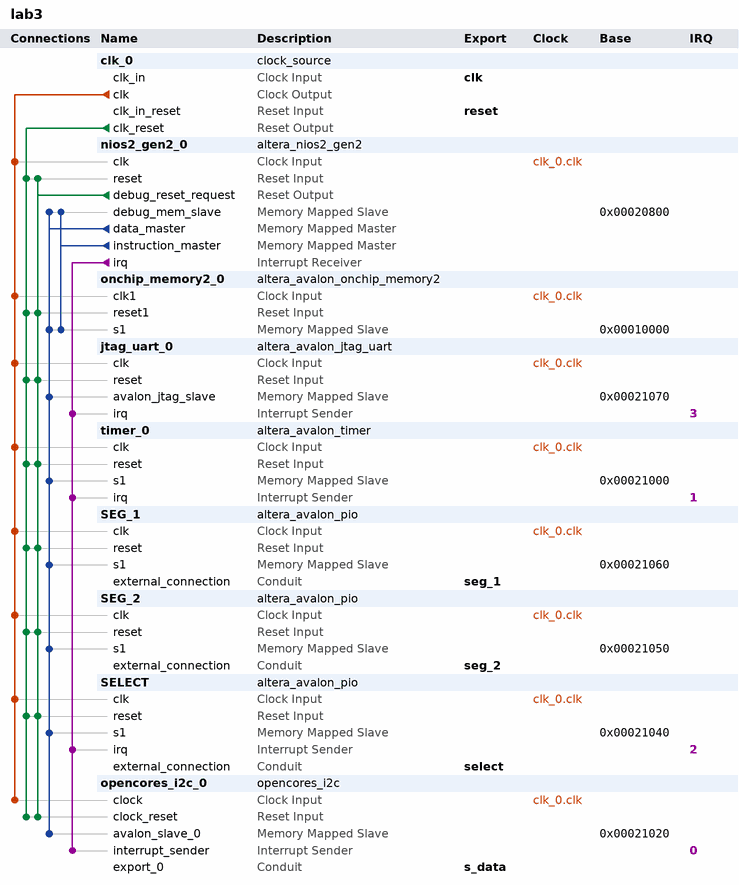
[diagram p0: system contents]
# Platform Designer (Qsys) system lab3, MAX 10 10M50DAF484C7G
# Parameters at their usual value, and those the tool derives, are not listed.
package require -exact qsys 18.1
create_system lab3
set_project_property DEVICE_FAMILY {MAX 10}
set_project_property DEVICE 10M50DAF484C7G

add_instance clk_0 clock_source 18.1
set_instance_parameter_value clk_0 clockFrequency 50000000

add_instance nios2_gen2_0 altera_nios2_gen2 18.1
set_instance_parameter_value nios2_gen2_0 dcache_size 2048
set_instance_parameter_value nios2_gen2_0 exceptionSlave onchip_memory2_0.s1
set_instance_parameter_value nios2_gen2_0 icache_size 4096
set_instance_parameter_value nios2_gen2_0 impl Tiny
set_instance_parameter_value nios2_gen2_0 resetSlave onchip_memory2_0.s1

add_instance onchip_memory2_0 altera_avalon_onchip_memory2 18.1
set_instance_parameter_value onchip_memory2_0 dataWidth 32
set_instance_parameter_value onchip_memory2_0 dualPort false
set_instance_parameter_value onchip_memory2_0 initMemContent false
set_instance_parameter_value onchip_memory2_0 initializationFileName onchip_mem.hex
set_instance_parameter_value onchip_memory2_0 memorySize 40000

add_instance jtag_uart_0 altera_avalon_jtag_uart 18.1
set_instance_parameter_value jtag_uart_0 simInteractiveOptions NO_INTERACTIVE_WINDOWS

add_instance timer_0 altera_avalon_timer 18.1
set_instance_parameter_value timer_0 period 1
set_instance_parameter_value timer_0 periodUnits SEC

add_instance SEG_1 altera_avalon_pio 18.1
set_instance_parameter_value SEG_1 direction Output
set_instance_parameter_value SEG_1 width 12

add_instance SEG_2 altera_avalon_pio 18.1
set_instance_parameter_value SEG_2 direction Output
set_instance_parameter_value SEG_2 width 12

add_instance SELECT altera_avalon_pio 18.1
set_instance_parameter_value SELECT captureEdge true
set_instance_parameter_value SELECT direction Input
set_instance_parameter_value SELECT edgeType FALLING
set_instance_parameter_value SELECT generateIRQ true
set_instance_parameter_value SELECT irqType EDGE
set_instance_parameter_value SELECT width 1

add_instance opencores_i2c_0 opencores_i2c 9.1

# connections
add_connection clk_0.clk jtag_uart_0.clk clock
add_connection clk_0.clk nios2_gen2_0.clk clock
add_connection clk_0.clk onchip_memory2_0.clk1 clock
add_connection clk_0.clk opencores_i2c_0.clock clock
add_connection clk_0.clk SEG_1.clk clock
add_connection clk_0.clk SEG_2.clk clock
add_connection clk_0.clk SELECT.clk clock
add_connection clk_0.clk timer_0.clk clock
add_connection clk_0.clk_reset jtag_uart_0.reset reset
add_connection clk_0.clk_reset nios2_gen2_0.reset reset
add_connection clk_0.clk_reset onchip_memory2_0.reset1 reset
add_connection clk_0.clk_reset opencores_i2c_0.clock_reset reset
add_connection clk_0.clk_reset SEG_1.reset reset
add_connection clk_0.clk_reset SEG_2.reset reset
add_connection clk_0.clk_reset SELECT.reset reset
add_connection clk_0.clk_reset timer_0.reset reset
add_connection nios2_gen2_0.debug_reset_request jtag_uart_0.reset reset
add_connection nios2_gen2_0.debug_reset_request nios2_gen2_0.reset reset
add_connection nios2_gen2_0.debug_reset_request onchip_memory2_0.reset1 reset
add_connection nios2_gen2_0.debug_reset_request opencores_i2c_0.clock_reset reset
add_connection nios2_gen2_0.debug_reset_request SEG_1.reset reset
add_connection nios2_gen2_0.debug_reset_request SEG_2.reset reset
add_connection nios2_gen2_0.debug_reset_request SELECT.reset reset
add_connection nios2_gen2_0.debug_reset_request timer_0.reset reset
add_connection nios2_gen2_0.data_master jtag_uart_0.avalon_jtag_slave avalon
set_connection_parameter_value nios2_gen2_0.data_master/jtag_uart_0.avalon_jtag_slave baseAddress 0x00021070
add_connection nios2_gen2_0.data_master nios2_gen2_0.debug_mem_slave avalon
set_connection_parameter_value nios2_gen2_0.data_master/nios2_gen2_0.debug_mem_slave baseAddress 0x00020800
add_connection nios2_gen2_0.data_master onchip_memory2_0.s1 avalon
set_connection_parameter_value nios2_gen2_0.data_master/onchip_memory2_0.s1 baseAddress 0x00010000
add_connection nios2_gen2_0.data_master opencores_i2c_0.avalon_slave_0 avalon
set_connection_parameter_value nios2_gen2_0.data_master/opencores_i2c_0.avalon_slave_0 baseAddress 0x00021020
add_connection nios2_gen2_0.data_master SEG_1.s1 avalon
set_connection_parameter_value nios2_gen2_0.data_master/SEG_1.s1 baseAddress 0x00021060
add_connection nios2_gen2_0.data_master SEG_2.s1 avalon
set_connection_parameter_value nios2_gen2_0.data_master/SEG_2.s1 baseAddress 0x00021050
add_connection nios2_gen2_0.data_master SELECT.s1 avalon
set_connection_parameter_value nios2_gen2_0.data_master/SELECT.s1 baseAddress 0x00021040
add_connection nios2_gen2_0.data_master timer_0.s1 avalon
set_connection_parameter_value nios2_gen2_0.data_master/timer_0.s1 baseAddress 0x00021000
add_connection nios2_gen2_0.instruction_master nios2_gen2_0.debug_mem_slave avalon
set_connection_parameter_value nios2_gen2_0.instruction_master/nios2_gen2_0.debug_mem_slave baseAddress 0x00020800
add_connection nios2_gen2_0.instruction_master onchip_memory2_0.s1 avalon
set_connection_parameter_value nios2_gen2_0.instruction_master/onchip_memory2_0.s1 baseAddress 0x00010000
add_connection nios2_gen2_0.irq jtag_uart_0.irq interrupt
set_connection_parameter_value nios2_gen2_0.irq/jtag_uart_0.irq irqNumber 3
add_connection nios2_gen2_0.irq opencores_i2c_0.interrupt_sender interrupt
set_connection_parameter_value nios2_gen2_0.irq/opencores_i2c_0.interrupt_sender irqNumber 0
add_connection nios2_gen2_0.irq SELECT.irq interrupt
set_connection_parameter_value nios2_gen2_0.irq/SELECT.irq irqNumber 2
add_connection nios2_gen2_0.irq timer_0.irq interrupt
set_connection_parameter_value nios2_gen2_0.irq/timer_0.irq irqNumber 1

# exported interfaces
add_interface clk clock sink
set_interface_property clk EXPORT_OF clk_0.clk_in
add_interface reset reset sink
set_interface_property reset EXPORT_OF clk_0.clk_in_reset
add_interface s_data conduit end
set_interface_property s_data EXPORT_OF opencores_i2c_0.export_0
add_interface seg_1 conduit end
set_interface_property seg_1 EXPORT_OF SEG_1.external_connection
add_interface seg_2 conduit end
set_interface_property seg_2 EXPORT_OF SEG_2.external_connection
add_interface select conduit end
set_interface_property select EXPORT_OF SELECT.external_connection

set_interconnect_requirement {$system} qsys_mm.clockCrossingAdapter HANDSHAKE
set_interconnect_requirement {$system} qsys_mm.enableEccProtection FALSE
set_interconnect_requirement {$system} qsys_mm.insertDefaultSlave FALSE
set_interconnect_requirement {$system} qsys_mm.maxAdditionalLatency 1

save_system lab3.qsys
